# EAGLE design working (EAGLE 9.3.2)
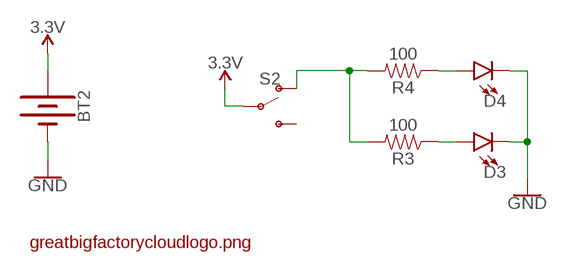
[diagram p0: schematic, sheet 1]

## Parts
BT2  BATTERY-20MM_PTH_KIT  [BATTCOM_20MM_PTH_KIT]
D3  LED5MM  [LED_5MM]
D4  LED5MM  [LED_5MM]
R3  100  100OHM-HORIZ_KIT-1/4W-1%  [AXIAL-0.3EZ]
R4  100  100OHM-HORIZ_KIT-1/4W-1%  [AXIAL-0.3EZ]
S2  SWITCH-SPDT-PTH-11.6X4.0MM-KIT  [SWITCH_SPDT_PTH_11.6X4.0MM_KIT]
U$1  GREATBIGFACTORYCLOUDLOGO#PNG  [GREATBIGFACTORYCLOUDLOGO#PNG]

## Nets
3.3V: BT2.1(+) S2.2(P)
GND: BT2.2(-) D3.K(C) D4.K(C)
N$1: R3.P$2 R4.P$2 S2.1(O)
N$5: D4.A R4.P$1
N$6: D3.A R3.P$1
Unconnected: S2.3(S)

## Library data of the parts
BT2 = SparkFun-Batteries:BATTERY: Battery - Single Cell A variety of battery chemistries, sizes, and footprints. Device List: 20MM_PTH - Coin Cell Battery Holder - 20mm (PTH) 20MM_PTH_KIT- Coin Cell battery Holder - 20 mm (PTH) kit version with special mask 6.8MM_PTH - Coin Cell Battery Holder - 6.8MM(SMD) 12MM_SMD - Coin Cell Battery Holder - 12mm (SMD) 12MM_PTH - Coin Cell Battery Holder - 12mm (PTH) 20MM_SMD - 20mm Coin Cell Battery Holder (SMD) (2 legs) Used on the Big Time Watch Kit 20MM_SMD_4LEGS - Coin Cell Battery Holder - 20mm (SMD) 20MM_SMD_4LEGS_OVERPASTE - Coin Cell Battery Holder - 20mm (SMD) (Over-paste on the legs) 24.5MM_PTH - Coin Cell Battery Holder - 24.5mm (PTH) 9V - 9V Battery Holder - PC Mount Used on the SparkFun SparkPunk Sound Kit and SparkFun SparkPunk Sequencer Kit 18650 - Battery Holder - 18650 (PTH) AA - Battery Holder - 1xAA (PTH) AAA - Battery Holder - 1xAAA (PTH) AA_KIT - Battery Holder - 1xAA (PTH) Special kit package - pads only have exposed copper on one side of the board. AAA_KIT - Battery Holder - 1xAAA (PTH) Special kit package - pads only have exposed copper on one side of the board.
D3 D4 = SparkFun-LED:LED: LED (Generic) Standard schematic elements and footprints for 5mm, 3mm, 1206, and 0603 sized LEDs. Generic LEDs with no color specified.
R3 R4 = SparkFun-Resistors:100OHM: 100Ω resistor A resistor is a passive two-terminal electrical component that implements electrical resistance as a circuit element. Resistors act to reduce current flow, and, at the same time, act to lower voltage levels within circuits. - Wikipedia; PROD_ID: RES-12181
S2 = SparkFun-Switches:SWITCH-SPDT: Single Pole, Double Throw (SPDT) Switch Single-pole, double-throw (SPDT) switch. Variant Overview SMD-AYZ0202 Surface Mount DPDT Switch (COM-00597) Used on e.g. LilyPad Arduino USB - ATmega32U4 Board PTH-11.6X4.0MM SPDT Mini Power Switch (COM-00102) Used on e.g. SparkFun Simon Says - Through-Hole Soldering Kit (KIT-10547) PTH-11.6X4.0MM-KIT KIT version of SPDT Mini Power Switch - Simplifies soldering by removing tStop of switch pins - only one side can be soldered. PTH-11.6X4.0MM-LOCK LOCK version of SPDT Mini Power Switch - Offset pins hold switch in place for easier soldering. SMD-RIGHT-ANGLE Surface Mount Right Angle Switch (COM-10860) Used on e.g. SparkFun ESP8266 Thing; PROD_ID: SWCH-08261; SF_SKU: COM-00102
U$1 = greatbigfactorycloudlogo#png:GREATBIGFACTORYCLOUDLOGO#PNG

## Board
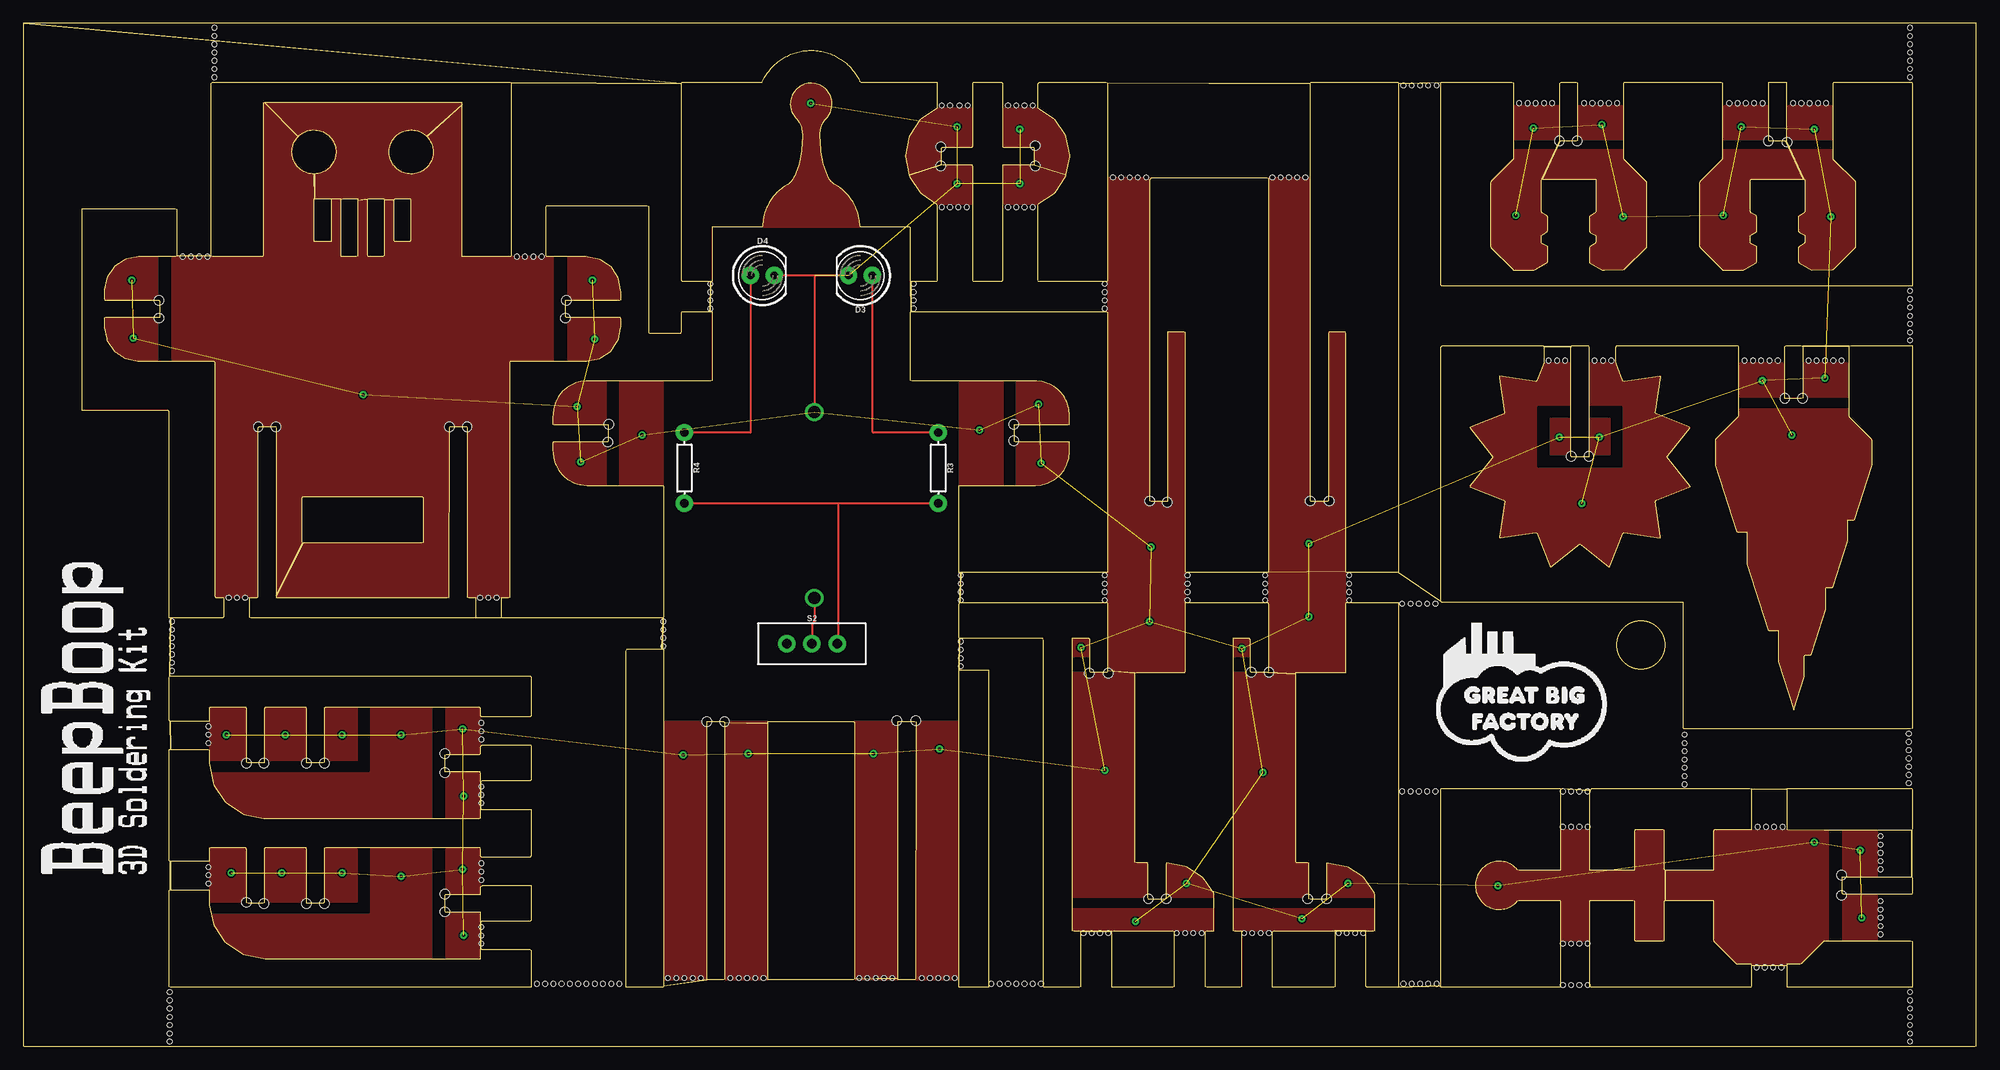
[diagram p1: board, top side]
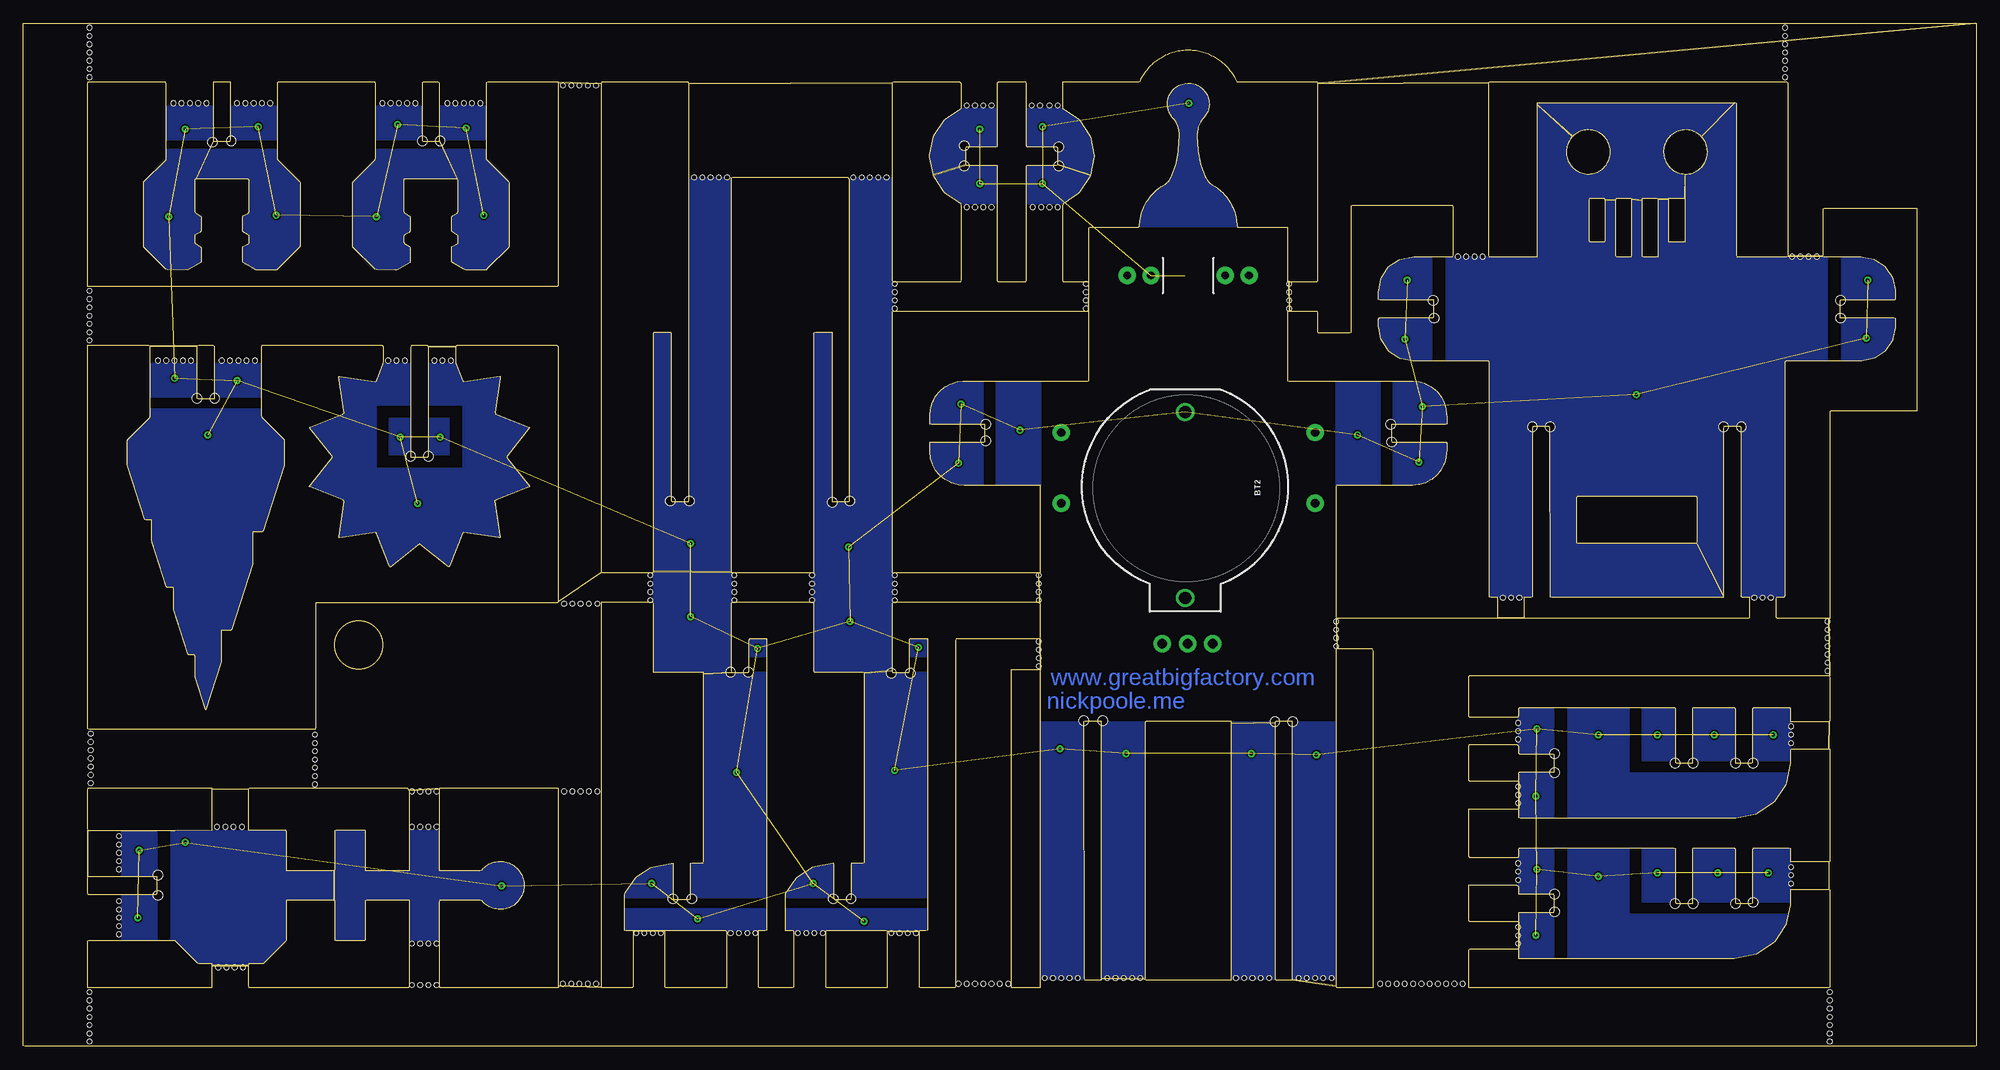
[diagram p2: board, bottom side, seen from below]

Size 210.07 x 110.08 mm. Coordinates in mm from the lower left corner, seen from the top.
Outline: 1497 segments
Outline: circle at 173.99,43.18 radius 2.59
Copper layers (1*16): Top 0.035mm / dielectric 1.5mm / Bottom 0.035mm
Design rules "default *": minimum track width 6mil, minimum drill 0.35mm, track to track 6mil, track to pad 6mil, pad to pad 6mil, via to via 6mil, smd to smd 6mil, copper to edge 0mil, drill to drill 6mil, minimum pad ring 10mil, minimum via ring 8mil, stop-mask expansion 4mil, vias tented up to drill 0mil, thermal gap 10mil
Holes 0.51 mm at 17.14,84.96 18.03,84.96 18.92,84.96 19.81,84.96 53.09,84.96 53.98,84.96 54.86,84.96 55.75,84.96 22.1,48.26 22.99,48.26 23.88,48.26 49.15,48.26 50.04,48.26 50.93,48.26 19.94,34.42 19.94,33.53 19.94,32.64 19.94,19.3 19.94,18.41 19.94,17.53 49.28,34.8 49.28,33.91 49.28,33.02 49.28,27.94 49.28,27.05 49.28,26.16 49.28,19.68 49.28,18.8 49.28,17.91 49.28,12.83 49.28,11.94 49.28,11.05 73.91,82.04 73.91,81.15 73.91,80.26 73.91,79.38 68.83,45.72 68.83,44.83 68.83,43.94 68.83,43.05 69.34,7.37 70.23,7.37 71.12,7.37 72.01,7.37 72.9,7.37 76.07,7.37 76.96,7.37 77.85,7.37 78.74,7.37 79.63,7.37 89.92,7.37 90.81,7.37 91.69,7.37 92.58,7.37 93.47,7.37 96.65,7.37 97.54,7.37 98.42,7.37 99.31,7.37 100.2,7.37 100.84,50.67 100.84,49.78 100.84,48.9 100.84,48.01 95.76,82.04 95.76,81.15 95.76,80.26 95.76,79.38 100.84,43.56 100.84,42.67 100.84,41.78 100.84,40.89 98.81,101.22 99.69,101.22 100.71,101.22 101.6,101.22 105.92,101.22 106.81,101.22 107.7,101.22 108.58,101.22 98.81,90.3 99.69,90.3 100.58,90.3 101.47,90.3 105.92,90.3 106.81,90.3 107.7,90.3 108.58,90.3 116.33,82.04 116.33,81.15 116.33,80.26 116.33,79.38 16,45.72 16,44.83 16,43.94 16,43.05 16,42.16 16,41.27 16,40.39 55.24,6.73 56.13,6.73 57.02,6.73 57.91,6.73 58.8,6.73 59.69,6.73 60.58,6.73 61.47,6.73 62.36,6.73 63.25,6.73 64.14,6.73 105.03,6.73 105.92,6.73 106.81,6.73 107.7,6.73 108.58,6.73 109.47,6.73 104.14,6.73 114.05,12.19 114.94,12.19 115.82,12.19 116.71,12.19 124.08,12.19 124.97,12.19 125.86,12.19 126.75,12.19 131.32,12.19 132.21,12.19 133.1,12.19 133.99,12.19 141.48,12.19 142.37,12.19 143.26,12.19 144.15,12.19 116.33,50.67 116.33,49.78 116.33,48.9 116.33,48.01 125.22,50.67 125.22,49.78 125.22,48.9 125.22,48.01 133.6,50.67 133.6,49.78 133.6,48.9 133.6,48.01 142.62,50.67 142.62,49.78 142.62,48.9 142.62,48.01 117.22,93.47 118.11,93.47 119,93.47 119.89,93.47 120.78,93.47 134.37,93.47 135.25,93.47 136.14,93.47 137.03,93.47 137.92,93.47 148.46,6.73 149.35,6.73 150.24,6.73 151.13,6.73 152.02,6.73 148.46,103.38 149.35,103.38 150.24,103.38 151.13,103.38 152.02,103.38 15.75,2.29 15.75,3.17 15.75,4.06 15.75,4.95 15.75,5.84 15.75,1.4 15.75,0.51 20.57,104.27 20.57,105.16 20.57,106.05 20.57,106.93 20.57,107.82 20.57,108.71 20.57,109.6 202.95,104.27 202.95,105.16 202.95,106.05 202.95,106.93 202.95,107.82 202.95,108.71 202.95,109.6 202.95,2.29 202.95,3.17 202.95,4.06 202.95,4.95 202.95,5.84 202.95,1.4 202.95,0.51 202.82,30.1 202.82,30.99 202.82,31.88 202.82,32.77 202.82,33.66 202.82,29.21 202.82,28.32 202.95,77.72 202.95,78.61 202.95,79.5 202.95,80.39 202.95,81.28 202.95,76.83 202.95,75.95 199.77,12.95 199.77,13.84 199.77,14.73 199.77,15.62 199.77,12.06 199.77,19.94 199.77,20.83 199.77,21.72 199.77,22.61 199.77,19.05 165.61,6.6 166.5,6.6 167.39,6.6 168.28,6.6 165.61,11.05 166.5,11.05 167.39,11.05 168.28,11.05 165.61,23.62 166.5,23.62 167.39,23.62 168.28,23.62 165.61,27.43 166.5,27.43 167.39,27.43 168.28,27.43 186.44,8.51 187.32,8.51 188.21,8.51 189.1,8.51 186.56,23.62 187.45,23.62 188.34,23.62 189.23,23.62 160.91,101.47 161.8,101.47 162.69,101.47 163.58,101.47 164.47,101.47 167.89,101.47 168.78,101.47 169.67,101.47 170.56,101.47 171.45,101.47 183.51,101.47 184.4,101.47 185.29,101.47 186.18,101.47 187.07,101.47 190.37,101.47 191.26,101.47 192.15,101.47 193.04,101.47 193.93,101.47 192.02,73.79 192.91,73.79 193.8,73.79 194.69,73.79 195.58,73.79 185.17,73.79 186.06,73.79 186.94,73.79 187.83,73.79 188.72,73.79 164.08,73.79 164.97,73.79 165.86,73.79 169.04,73.79 169.93,73.79 170.81,73.79 151.89,27.43 151,27.43 150.11,27.43 149.22,27.43 148.34,27.43 178.69,33.53 178.69,32.64 178.69,31.75 178.69,30.86 178.69,29.97 178.69,29.08 178.69,28.19 148.34,47.62 149.22,47.62 150.11,47.62 151,47.62 151.89,47.62
Holes 1.02 mm at 14.61,80.26 14.61,78.36 58.42,80.26 58.29,78.36 47.75,66.67 45.85,66.67 27.18,66.67 25.27,66.67 24,30.48 25.91,30.48 30.48,30.48 32.38,30.48 45.34,31.5 45.34,29.46 24,15.49 25.91,15.37 30.48,15.37 32.38,15.37 45.34,16.38 45.34,14.48 62.99,66.93 62.87,65.02 106.55,66.93 106.55,65.15 73.53,34.92 75.44,34.92 93.98,35.05 96.01,35.05 98.68,96.77 98.68,94.74 108.84,96.9 108.84,94.74 123.06,58.55 121.16,58.67 114.68,40.13 116.71,40.13 121.03,15.88 122.94,15.88 138.18,15.88 140.21,15.88 132.08,40.26 133.99,40.26 138.43,58.67 140.46,58.67 195.58,18.41 195.58,16.26 191.39,69.72 189.48,69.72 168.4,63.5 166.5,63.5 189.74,97.28 187.71,97.41 167.13,97.41 165.23,97.41

### Footprints (pad centres in the part's own frame; a part is rotated, then mirrored left to right if it is on the bottom)
BATTCOM_20MM_PTH_KIT = drill 1.3: 1 11.85,0; 2 -8.15,0
LED_5MM = drill 0.813 pad 1.88: A -1.27,0; K 1.27,0
AXIAL-0.3EZ = drill 0.9 pad 1.88: P$1 -3.81,0; P$2 3.81,0
SWITCH_SPDT_PTH_11.6X4.0MM_KIT = drill 1.016 pad 1.88: 1 0,2.718; 2 0,0; 3 0,-2.718

### Placement (x,y rotation side)
BT2  85.09,60.11 270 bottom
D3  90.04,82.93 180 top
D4  79.5,82.93 0 top
R3  98.42,62.23 270 top
R4  71.12,62.23 270 top
S2  84.84,43.31 270 top
U$1  161.29,38.1 0 top
U$2  [RECT1468#PNG]  7.62,35.56 90 top

### Tracks (layer width: path | path; a pad name or v marks a point on that pad's centre or on a via)
3.3V
  Top 0.203: BT2.1 85.09,45.72 84.84,45.47 S2.2
GND  (via drill 0.35)  (63 unrouted)
  Top 0.203: D3.K D4.K | 85.09,82.93 BT2.2
  other vias: 11.68,82.42 11.81,76.2 61.47,76.07 61.21,82.42 36.58,70.1 21.84,33.53 28.19,33.53 34.29,33.53 40.64,33.53 47.24,34.16 47.37,26.92 47.24,19.05 47.37,11.94 40.64,18.29 34.29,18.67 27.81,18.67 22.35,18.67 84.71,101.47 59.56,68.83 59.94,62.87 66.55,65.79 102.87,66.29 109.22,69.09 109.47,62.74 70.99,31.37 77.98,31.5 91.44,31.5 98.55,32 100.46,98.93 100.46,92.84 107.19,92.84 107.19,98.68 121.28,53.72 138.3,54.1 121.16,45.72 138.3,46.23 116.33,29.72 133.35,29.46 113.79,42.93 131.06,42.8 125.09,17.53 142.49,17.53 119.63,13.46 137.54,13.72 162.43,98.81 169.8,99.19 184.78,98.93 192.66,98.68 194.44,89.28 182.88,89.41 172.09,89.28 160.53,89.41 165.23,65.53 169.54,65.53 167.64,58.42 187.07,71.63 193.8,71.88 190.25,65.79 158.62,17.27 192.66,21.97 197.61,21.08 197.74,13.84
  cutout Top: 15.88,85.09 15.88,73.66 14.61,73.66 14.61,85.09
  cutout Top: 58.42,85.09 58.42,73.66 57.15,73.66 57.15,85.09
  cutout Bottom: 14.61,85.09 15.88,85.09 15.88,73.66 14.61,73.66
  cutout Bottom: 57.15,85.09 58.42,85.09 58.42,73.66 57.15,73.66
  cutout Bottom: 106.68,71.63 106.68,60.33 105.54,60.33 105.54,71.63
  cutout Bottom: 62.87,71.63 62.87,60.33 64.01,60.33 64.01,71.63
  cutout Top: 62.87,71.63 64.01,71.63 64.01,60.33 62.87,60.33
  cutout Top: 105.54,71.63 106.68,71.63 106.68,60.33 105.54,60.33
  cutout Top: 19.94,30.61 36.07,30.61 36.07,36.45 37.21,36.45 37.21,29.59 19.94,29.59
  cutout Top: 19.94,15.37 36.07,15.37 36.07,21.46 37.21,21.46 37.21,14.35 19.94,14.35
  cutout Bottom: 36.07,36.45 37.21,36.45 37.21,29.59 19.94,29.59 19.94,30.61 36.07,30.61
  cutout Bottom: 37.21,21.46 37.21,14.35 19.94,14.35 19.94,15.37 36.07,15.37 36.07,21.46
  cutout Bottom: 45.34,36.45 45.34,24.51 44.07,24.51 44.07,36.45 45.21,36.45
  cutout Bottom: 45.34,21.34 45.34,9.4 44.32,9.4 44.07,9.4 44.07,21.34
  cutout Top: 44.07,21.34 45.34,21.34 45.34,9.4 44.07,9.4
  cutout Top: 44.07,36.45 44.07,24.51 45.34,24.51 45.34,36.45
  cutout Top: 114.81,40.39 112.78,40.39 112.78,41.78 114.81,41.78
  cutout Bottom: 112.78,41.78 114.81,41.78 114.81,40.39 112.78,40.39
  cutout Bottom: 132.08,41.78 130.05,41.78 130.05,40.39 132.08,40.39
  cutout Top: 130.05,41.78 130.05,40.39 132.08,40.39 132.08,41.78
  cutout Top: 160.15,97.41 172.21,97.41 172.21,96.65 160.15,96.65
  cutout Bottom: 160.15,97.41 172.21,97.41 172.21,96.65 160.15,96.65
  cutout Bottom: 182.75,97.41 194.69,97.41 194.69,96.65 182.75,96.65
  cutout Top: 182.75,97.41 182.75,96.65 194.69,96.65 194.69,97.41
  cutout Top: 184.4,69.72 196.47,69.72 196.47,68.71 184.4,68.71
  cutout Bottom: 184.4,69.72 196.47,69.72 196.47,68.71 184.4,68.71
  cutout Bottom: 195.58,23.24 195.58,11.3 194.31,11.3 194.31,23.24
  cutout Top: 194.31,23.24 195.58,23.24 195.58,11.3 194.31,11.3
  cutout Top: 164.08,63.5 170.81,63.5 170.81,67.69 168.4,67.69 168.4,68.83 171.96,68.83 171.96,62.36 162.94,62.36 162.94,68.83 166.5,68.83 166.5,67.69 164.08,67.69
  cutout Bottom: 168.4,68.83 171.96,68.83 171.96,62.36 162.94,62.36 162.94,68.83 166.5,68.83 166.5,67.69 164.08,67.69 164.08,63.5 170.81,63.5 170.81,67.69 168.4,67.69
  cutout Bottom: 112.78,15.88 145.54,15.88 145.54,14.99 112.78,14.99
  cutout Top: 112.78,15.88 145.54,15.88 145.54,14.99 112.78,14.99
N$1
  Top 0.203: R3.P$2 87.63,58.42 | 87.63,58.42 R4.P$2 | S2.1 87.63,43.39 87.63,58.42
N$5
  Top 0.203: D4.A 78.23,66.04 R4.P$1
N$6
  Top 0.203: D3.A 91.31,66.17 91.44,66.04 R3.P$1
S$1
  pour Top: 84.31,103.59 83.92,103.47 83.74,103.39 83.57,103.29 83.41,103.18 83.25,103.05 83.11,102.91 82.98,102.76 82.86,102.6 82.77,102.42 82.67,102.25 82.56,101.86 82.53,101.67 82.51,101.47 82.52,101.27 82.62,100.68 82.71,100.5 82.99,99.98 83.14,99.84 83.39,99.53 83.48,99.35 83.66,98.99 83.72,98.81 83.8,98.21 83.82,98.01 83.72,96.42 83.46,95.04 83.42,94.85 83.01,93.72 82.93,93.54 82.72,93.2 82.59,93.05 82.45,92.91 82.3,92.78 81.79,92.47 81.63,92.35 81.32,92.1 81.17,91.97 80.75,91.53 80.63,91.38 80.4,91.05 80.28,90.89 80,90.36 79.93,90.18 79.72,89.61 79.59,89.03 79.56,88.83 79.52,88.23 79.63,88.15 89.82,88.15 90.01,88.16 89.96,88.76 89.94,88.96 89.81,89.54 89.76,89.73 89.55,90.3 89.46,90.47 89.27,90.82 89.17,91 88.82,91.48 88.68,91.63 88.41,91.92 88.26,92.06 87.8,92.43 87.63,92.54 87.28,92.74 87.12,92.85 86.83,93.13 86.62,93.47 86.52,93.64 86.12,94.77 86.07,94.96 85.82,96.34 85.79,96.54 85.7,97.93 85.71,98.13 85.78,98.73 85.83,98.92 85.99,99.28 86.08,99.46 86.33,99.77 86.47,99.91 86.78,100.42 86.88,100.6 87.02,101.38 86.98,101.78 86.93,101.98 86.87,102.17 86.79,102.35 86.7,102.52 86.59,102.69 86.46,102.85 86.33,103 86.02,103.25 85.67,103.44 85.49,103.51 85.3,103.57 85.1,103.6 84.9,103.62 84.7,103.63
S$2
  pour Top: 68.88,71.58 60.68,71.58 60.48,71.57 60.08,71.53 59.88,71.5 59.31,71.32 59.13,71.25 58.6,70.96 58.44,70.84 58.13,70.58 57.99,70.44 57.61,69.98 57.51,69.81 57.32,69.46 57.23,69.27 57.06,68.7 57.02,68.5 56.96,67.91 56.96,67.11 56.98,66.92 62.78,66.92 62.92,66.86 62.92,65.06 62.77,65.02 56.96,65.02 56.96,64.22 56.97,64.02 57.03,63.42 57.06,63.23 57.24,62.65 57.33,62.47 57.52,62.12 57.62,61.95 58,61.49 58.15,61.35 58.46,61.1 58.61,60.97 59.14,60.69 59.33,60.61 59.9,60.44 60.5,60.38 60.7,60.36 68.7,60.36 68.88,60.38
S$3
  pour Top: 68.88,34.95 68.88,7.31 68.93,7.16 73.54,7.16 73.54,34.8 73.49,34.95
S$4
  pour Top: 75.44,34.95 75.44,7.31 75.49,7.16 80.1,7.16 80.1,34.8 80.05,34.95
S$5
  pour Top: 89.42,34.95 89.42,7.31 89.47,7.16 94.08,7.16 94.08,34.8 94.03,34.95
S$6
  pour Top: 96.03,34.95 95.98,7.33 96.02,7.16 100.62,7.16 100.64,7.34 100.64,34.76 100.63,34.95
S$7
  pour Top: 100.64,60.36 108.84,60.36 109.04,60.38 109.44,60.42 109.64,60.44 110.21,60.62 110.39,60.7 110.92,60.98 111.08,61.11 111.39,61.36 111.53,61.5 111.91,61.96 112.01,62.14 112.2,62.49 112.29,62.67 112.46,63.24 112.5,63.44 112.56,64.04 112.56,64.84 112.54,65.02 106.74,65.02 106.6,65.08 106.6,66.88 106.76,66.92 112.56,66.92 112.56,67.72 112.55,67.92 112.49,68.52 112.46,68.72 112.28,69.29 112.19,69.47 112,69.82 111.9,69.99 111.52,70.46 111.37,70.59 111.06,70.85 110.91,70.97 110.38,71.26 110.19,71.33 109.62,71.51 109.42,71.53 109.02,71.57 108.82,71.58 100.82,71.58 100.64,71.56
S$8
  pour Top: 202 corners
S$9
  pour Top: 122.91,15.84 121.11,15.84 121,15.93 121,19.54 120.99,19.73 119.59,19.73 119.59,19.92 119.59,40.13 119.67,40.24 124.87,40.24 124.99,40.33 124.99,76.74 124.92,76.87 123.12,76.87 123.08,76.71 123.08,58.71 122.99,58.6 121.19,58.6 121.17,58.79 121.17,93.4 121.02,93.44 116.82,93.44 116.62,93.44 116.62,40.43 116.61,40.24 114.8,40.24 114.72,40.36 114.72,43.76 114.62,43.86 112.82,43.86 112.81,43.68 112.81,12.47 112.99,12.45 128,12.45 128.08,12.57 128.08,16.37 127.98,16.55 126.97,18.04 126.85,18.2 125.17,19.27 124.99,19.34 123.02,19.71 122.91,19.64
S$10
  pour Top: 94.87,95.78 95.31,93.61 95.41,93.45 96.42,91.95 96.54,91.79 98.2,90.67 98.38,90.61 101.99,90.61 102.14,90.65 102.14,94.66 102.1,94.81 98.89,94.82 98.76,94.89 98.76,96.69 98.9,96.74 102.11,96.73 102.14,96.9 102.14,100.9 101.99,100.94 98.38,100.94 98.2,100.88 96.54,99.76 96.42,99.6 95.41,98.11 95.31,97.94 94.87,95.78
S$11
  pour Top: 20,36.44 20,30.65 20,30.45 20.44,28.29 20.51,28.11 21.74,26.28 21.9,26.17 23.56,25.05 23.74,24.98 25.89,24.54 26.09,24.53 49.08,24.53 49.21,24.6 49.21,29.4 49.15,29.53 45.55,29.53 45.37,29.55 45.37,31.35 45.49,31.44 49.08,31.44 49.21,31.51 49.21,36.31 49.15,36.44 32.55,36.44 32.38,36.41 32.38,30.62 32.31,30.49 30.51,30.49 30.48,30.65 30.48,36.25 30.47,36.44 26.07,36.44 25.92,36.39 25.92,30.6 25.83,30.49 24.04,30.49 24.02,30.67 24.02,36.27 24,36.44
S$12
  pour Top: 140.2,15.84 138.4,15.84 138.29,15.93 138.29,19.54 138.28,19.73 136.88,19.73 136.88,19.92 136.88,40.13 136.96,40.24 142.16,40.24 142.28,40.33 142.28,76.74 142.21,76.87 140.41,76.87 140.37,76.71 140.37,58.71 140.28,58.6 138.48,58.6 138.47,58.79 138.47,93.4 138.31,93.44 134.11,93.44 133.91,93.44 133.91,40.43 133.9,40.24 132.1,40.24 132.01,40.36 132.01,43.76 131.92,43.86 130.12,43.86 130.1,43.68 130.1,12.47 130.29,12.45 145.29,12.45 145.37,12.57 145.37,16.37 145.28,16.55 144.27,18.04 144.15,18.2 142.46,19.27 142.28,19.34 140.31,19.71 140.2,19.64
S$13
  pour Top: 174.64,92.99 172.24,95.4 172.17,95.57 172.17,101.17 172.03,101.23 167.23,101.23 167.17,101.09 167.17,97.49 167.07,97.39 165.27,97.39 165.26,97.58 165.26,101.18 165.11,101.23 160.31,101.23 160.26,101.08 160.26,95.48 160.13,95.33 157.87,93.07 157.79,92.9 157.79,86.1 157.87,85.93 160.14,83.68 160.28,83.54 162.48,83.53 162.67,83.59 163.88,84.29 164,84.42 164,85.82 163.98,86.02 163.29,86.42 163.28,86.61 163.28,87.21 163.43,87.33 163.95,87.63 164,87.8 164,89.2 163.92,89.35 163.4,89.65 163.28,89.79 163.28,93.19 163.36,93.31 168.96,93.31 169.15,93.29 169.15,89.89 169.13,89.71 168.61,89.41 168.44,89.31 168.44,87.71 168.57,87.58 169.09,87.28 169.15,87.12 169.15,86.52 169.06,86.37 168.54,86.07 168.44,85.93 168.44,84.53 168.46,84.34 169.85,83.55 170.04,83.54 172.04,83.55 172.23,83.59 174.63,86 174.64,86.19
S$14
  pour Top: 20,21.35 20,15.56 20.01,15.36 20.44,13.2 20.51,13.02 21.74,11.19 21.9,11.08 23.56,9.96 23.74,9.89 25.89,9.45 26.09,9.44 49.08,9.44 49.21,9.51 49.21,14.31 49.15,14.44 45.55,14.44 45.37,14.47 45.37,16.26 45.49,16.35 49.09,16.35 49.21,16.42 49.21,21.22 49.15,21.35 32.55,21.35 32.38,21.33 32.38,15.53 32.31,15.4 30.51,15.4 30.48,15.56 30.48,21.16 30.47,21.35 26.08,21.35 25.93,21.3 25.93,15.51 25.84,15.4 24.04,15.4 24.02,15.58 24.02,21.18 24,21.35
S$15
  pour Top: 112.59,95.78 112.16,97.94 112.05,98.11 111.05,99.6 110.93,99.76 109.26,100.88 109.08,100.94 105.48,100.94 105.32,100.9 105.32,96.9 105.35,96.73 108.56,96.74 108.71,96.69 108.71,94.89 108.57,94.82 105.37,94.81 105.32,94.66 105.32,90.65 105.48,90.61 109.08,90.61 109.26,90.67 110.93,91.79 111.05,91.95 112.05,93.45 112.16,93.61 112.59,95.78
S$16
  pour Top: 197.14,92.99 194.73,95.4 194.67,95.57 194.67,101.17 194.53,101.23 189.73,101.23 189.67,101.09 189.67,97.49 189.57,97.39 187.77,97.39 187.76,97.58 187.76,101.18 187.61,101.23 182.81,101.23 182.76,101.08 182.76,95.48 182.63,95.33 180.37,93.07 180.29,92.9 180.29,86.1 180.37,85.93 182.64,83.68 182.78,83.54 184.98,83.53 185.17,83.59 186.38,84.29 186.5,84.42 186.5,85.82 186.48,86.02 185.79,86.42 185.78,86.61 185.78,87.21 185.92,87.33 186.44,87.63 186.5,87.8 186.5,89.2 186.42,89.35 185.9,89.65 185.78,89.79 185.78,93.19 185.86,93.31 191.46,93.31 191.65,93.29 191.65,89.89 191.62,89.71 191.1,89.41 190.93,89.31 190.93,87.71 191.06,87.58 191.58,87.28 191.65,87.12 191.65,86.52 191.56,86.37 191.04,86.07 190.93,85.93 190.93,84.53 190.96,84.35 192.34,83.55 192.54,83.54 194.54,83.55 194.72,83.59 197.12,86 197.14,86.19
S$17
  pour Top: 198.87,65.27 196.46,67.68 196.4,67.85 196.4,73.45 196.26,73.51 191.46,73.51 191.4,73.38 191.4,69.78 191.3,69.67 189.5,69.67 189.49,69.86 189.49,73.46 189.34,73.51 184.54,73.51 184.49,73.37 184.49,67.77 184.36,67.62 182.1,65.36 182.02,65.19 182.02,62.59 182.06,62.4 184.31,55.35 184.5,55.33 185.3,55.33 185.4,55.23 185.41,52.03 185.44,51.83 187.69,44.78 187.87,44.75 188.67,44.75 188.78,44.67 188.77,41.47 188.82,41.28 190.4,36.32 190.46,36.25 191.56,39.68 191.59,39.88 191.59,42.08 191.78,42.09 192.18,42.1 192.35,42.14 193.87,46.91 193.91,47.1 193.91,49.3 194.05,49.36 194.65,49.36 194.72,49.55 196.24,54.31 196.24,54.51 196.24,56.51 196.32,56.64 196.92,56.64 197.02,56.76 198.85,62.48 198.87,62.67
S$18
  pour Top: 179.33,66.59 175.6,68.06 175.56,68.21 176.12,71.97 176.07,72.09 172.32,71.53 172.12,71.5 171.39,73.37 171.29,73.51 168.48,73.51 168.4,73.4 168.4,63.59 168.39,63.41 166.58,63.41 166.49,63.52 166.49,73.32 166.49,73.51 163.68,73.51 163.54,73.44 162.8,71.57 162.65,71.52 158.89,72.08 158.76,72.05 159.35,68.09 159.18,68.01 155.64,66.62 155.65,66.49 158.01,63.52 158.07,63.36 155.57,60.23 155.75,60.16 159.28,58.76 159.33,58.61 158.77,54.85 158.81,54.72 162.77,55.31 162.84,55.13 164.24,51.6 164.36,51.61 167.34,53.98 167.49,54.02 170.63,51.53 170.7,51.71 172.09,55.25 172.25,55.3 176.01,54.73 176.13,54.78 175.54,58.73 175.72,58.81 179.26,60.2 179.24,60.33 176.88,63.3 176.83,63.46
S$19
  pour Top: 181.81,23.28 181.81,19.08 181.75,18.93 176.55,18.93 176.52,19.1 176.52,23.11 176.49,23.28 173.49,23.28 173.3,23.27 173.3,19.07 173.23,18.93 168.63,18.93 168.54,19.04 168.54,23.24 168.37,23.28 165.37,23.28 165.32,23.13 165.32,19.13 165.31,18.93 160.91,18.93 160.73,18.98 159.95,19.61 159.77,19.68 158.79,19.91 158.59,19.88 157.81,19.72 157.64,19.62 156.97,19.18 156.85,19.02 156.41,18.35 156.35,18.17 156.19,17.38 156.21,17.18 156.37,16.4 156.45,16.22 156.9,15.56 157.05,15.43 157.71,14.98 157.89,14.92 158.68,14.76 158.87,14.76 159.85,14.99 160.01,15.09 160.64,15.59 160.8,15.72 165.2,15.72 165.32,15.64 165.32,11.43 165.44,11.35 168.44,11.35 168.54,11.45 168.54,15.66 168.68,15.72 173.28,15.72 173.3,15.54 173.3,11.54 173.32,11.35 176.52,11.35 176.52,15.55 176.56,15.72 181.76,15.72 181.8,15.56 181.8,11.56 181.81,11.36 184.21,8.95 184.38,8.89 191.18,8.89 191.34,8.98 193.61,11.24 193.76,11.35 199.36,11.35 199.49,11.42 199.49,16.22 199.42,16.36 195.82,16.36 195.65,16.38 195.65,18.19 195.77,18.26 199.37,18.26 199.49,18.35 199.49,23.15 199.41,23.27 193.61,23.27
S$20
  pour Bottom: 84.31,103.59 83.92,103.47 83.74,103.39 83.57,103.29 83.41,103.18 83.25,103.05 83.11,102.91 82.98,102.76 82.86,102.6 82.77,102.42 82.67,102.25 82.56,101.86 82.53,101.67 82.51,101.47 82.52,101.27 82.62,100.68 82.71,100.5 82.99,99.98 83.14,99.84 83.39,99.53 83.48,99.35 83.66,98.99 83.72,98.81 83.8,98.21 83.82,98.01 83.72,96.42 83.46,95.04 83.42,94.85 83.01,93.72 82.93,93.54 82.72,93.2 82.59,93.05 82.45,92.91 82.3,92.78 81.79,92.47 81.63,92.35 81.32,92.1 81.17,91.97 80.75,91.53 80.63,91.38 80.4,91.05 80.28,90.89 80,90.36 79.93,90.18 79.72,89.61 79.59,89.03 79.56,88.83 79.52,88.23 79.63,88.15 89.82,88.15 90.01,88.16 89.96,88.76 89.94,88.96 89.81,89.54 89.76,89.73 89.55,90.3 89.46,90.47 89.27,90.82 89.17,91 88.82,91.48 88.68,91.63 88.41,91.92 88.26,92.06 87.8,92.43 87.63,92.54 87.28,92.74 87.12,92.85 86.83,93.13 86.62,93.47 86.52,93.64 86.12,94.77 86.07,94.96 85.82,96.34 85.79,96.54 85.7,97.93 85.71,98.13 85.78,98.73 85.83,98.92 85.99,99.28 86.08,99.46 86.33,99.77 86.47,99.91 86.78,100.42 86.88,100.6 87.02,101.38 86.98,101.78 86.93,101.98 86.87,102.17 86.79,102.35 86.7,102.52 86.59,102.69 86.46,102.85 86.33,103 86.02,103.25 85.67,103.44 85.49,103.51 85.3,103.57 85.1,103.6 84.9,103.62 84.7,103.63
S$21
  pour Bottom: 68.88,71.58 60.68,71.58 60.48,71.57 60.08,71.53 59.88,71.5 59.31,71.32 59.13,71.25 58.6,70.96 58.44,70.84 58.13,70.58 57.99,70.44 57.61,69.98 57.51,69.81 57.32,69.46 57.23,69.27 57.06,68.7 57.02,68.5 56.96,67.91 56.96,67.11 56.98,66.92 62.78,66.92 62.92,66.86 62.92,65.06 62.77,65.02 56.96,65.02 56.96,64.22 56.97,64.02 57.03,63.42 57.06,63.23 57.24,62.65 57.33,62.47 57.52,62.12 57.62,61.95 58,61.49 58.15,61.35 58.46,61.1 58.61,60.97 59.14,60.69 59.33,60.61 59.9,60.44 60.5,60.38 60.7,60.36 68.7,60.36 68.88,60.38
S$22
  pour Bottom: 68.88,34.95 68.88,7.31 68.93,7.16 73.54,7.16 73.54,34.8 73.49,34.95
S$23
  pour Bottom: 75.44,34.95 75.44,7.31 75.49,7.16 80.1,7.16 80.1,34.8 80.05,34.95
S$24
  pour Bottom: 89.42,34.95 89.42,7.31 89.47,7.16 94.08,7.16 94.08,34.8 94.03,34.95
S$25
  pour Bottom: 96.03,34.95 95.98,7.33 96.02,7.16 100.62,7.16 100.64,7.34 100.64,34.76 100.63,34.95
S$26
  pour Bottom: 100.64,60.36 108.84,60.36 109.04,60.38 109.44,60.42 109.64,60.44 110.21,60.62 110.39,60.7 110.92,60.98 111.08,61.11 111.39,61.36 111.53,61.5 111.91,61.96 112.01,62.14 112.2,62.49 112.29,62.67 112.46,63.24 112.5,63.44 112.56,64.04 112.56,64.84 112.54,65.02 106.74,65.02 106.6,65.08 106.6,66.88 106.76,66.92 112.56,66.92 112.56,67.72 112.55,67.92 112.49,68.52 112.46,68.72 112.28,69.29 112.19,69.47 112,69.82 111.9,69.99 111.52,70.46 111.37,70.59 111.06,70.85 110.91,70.97 110.38,71.26 110.19,71.33 109.62,71.51 109.42,71.53 109.02,71.57 108.82,71.58 100.82,71.58 100.64,71.56
S$27
  pour Bottom: 201 corners
S$28
  pour Bottom: 122.91,15.84 121.11,15.84 121,15.93 121,19.54 120.99,19.73 119.59,19.73 119.59,19.92 119.59,40.13 119.67,40.24 124.87,40.24 124.99,40.33 124.99,76.74 124.92,76.87 123.12,76.87 123.08,76.71 123.08,58.71 122.99,58.6 121.19,58.6 121.17,58.79 121.17,93.4 121.02,93.44 116.82,93.44 116.62,93.44 116.62,40.43 116.61,40.24 114.8,40.24 114.72,40.36 114.72,43.76 114.62,43.86 112.82,43.86 112.81,43.68 112.81,12.47 112.99,12.45 128,12.45 128.08,12.57 128.08,16.37 127.98,16.55 126.97,18.04 126.85,18.2 125.17,19.27 124.99,19.34 123.02,19.71 122.91,19.64
S$29
  pour Bottom: 94.87,95.78 95.31,93.61 95.41,93.45 96.42,91.95 96.54,91.79 98.2,90.67 98.38,90.61 101.99,90.61 102.14,90.65 102.14,94.66 102.1,94.81 98.89,94.82 98.76,94.89 98.76,96.69 98.9,96.74 102.11,96.73 102.14,96.9 102.14,100.9 101.99,100.94 98.38,100.94 98.2,100.88 96.54,99.76 96.42,99.6 95.41,98.11 95.31,97.94 94.87,95.78
S$30
  pour Bottom: 20,36.44 20,30.65 20,30.45 20.44,28.29 20.51,28.11 21.74,26.28 21.9,26.17 23.56,25.05 23.74,24.98 25.89,24.54 26.09,24.53 49.08,24.53 49.21,24.6 49.21,29.4 49.15,29.53 45.55,29.53 45.37,29.55 45.37,31.35 45.49,31.44 49.08,31.44 49.21,31.51 49.21,36.31 49.15,36.44 32.55,36.44 32.38,36.41 32.38,30.62 32.31,30.49 30.51,30.49 30.48,30.65 30.48,36.25 30.47,36.44 26.07,36.44 25.92,36.39 25.92,30.6 25.83,30.49 24.04,30.49 24.02,30.67 24.02,36.27 24,36.44
S$31
  pour Bottom: 140.2,15.84 138.4,15.84 138.29,15.93 138.29,19.54 138.28,19.73 136.88,19.73 136.88,19.92 136.88,40.13 136.96,40.24 142.16,40.24 142.28,40.33 142.28,76.74 142.21,76.87 140.41,76.87 140.37,76.71 140.37,58.71 140.28,58.6 138.48,58.6 138.47,58.79 138.47,93.4 138.31,93.44 134.11,93.44 133.91,93.44 133.91,40.43 133.9,40.24 132.1,40.24 132.01,40.36 132.01,43.76 131.92,43.86 130.12,43.86 130.1,43.68 130.1,12.47 130.29,12.45 145.29,12.45 145.37,12.57 145.37,16.37 145.28,16.55 144.27,18.04 144.15,18.2 142.46,19.27 142.28,19.34 140.31,19.71 140.2,19.64
S$32
  pour Bottom: 174.64,92.99 172.24,95.4 172.17,95.57 172.17,101.17 172.03,101.23 167.23,101.23 167.17,101.09 167.17,97.49 167.07,97.39 165.27,97.39 165.26,97.58 165.26,101.18 165.11,101.23 160.31,101.23 160.26,101.08 160.26,95.48 160.13,95.33 157.87,93.07 157.79,92.9 157.79,86.1 157.87,85.93 160.14,83.68 160.28,83.54 162.48,83.53 162.67,83.59 163.88,84.29 164,84.42 164,85.82 163.98,86.02 163.29,86.42 163.28,86.61 163.28,87.21 163.43,87.33 163.95,87.63 164,87.8 164,89.2 163.92,89.35 163.4,89.65 163.28,89.79 163.28,93.19 163.36,93.31 168.96,93.31 169.15,93.29 169.15,89.89 169.13,89.71 168.61,89.41 168.44,89.31 168.44,87.71 168.57,87.58 169.09,87.28 169.15,87.12 169.15,86.52 169.06,86.37 168.54,86.07 168.44,85.93 168.44,84.53 168.46,84.34 169.85,83.55 170.04,83.54 172.04,83.55 172.23,83.59 174.63,86 174.64,86.19
S$33
  pour Bottom: 20,21.35 20,15.56 20.01,15.36 20.44,13.2 20.51,13.02 21.74,11.19 21.9,11.08 23.56,9.96 23.74,9.89 25.89,9.45 26.09,9.44 49.08,9.44 49.21,9.51 49.21,14.31 49.15,14.44 45.55,14.44 45.37,14.47 45.37,16.26 45.49,16.35 49.09,16.35 49.21,16.42 49.21,21.22 49.15,21.35 32.55,21.35 32.38,21.33 32.38,15.53 32.31,15.4 30.51,15.4 30.48,15.56 30.48,21.16 30.47,21.35 26.08,21.35 25.93,21.3 25.93,15.51 25.84,15.4 24.04,15.4 24.02,15.58 24.02,21.18 24,21.35
S$34
  pour Bottom: 112.59,95.78 112.16,97.94 112.05,98.11 111.05,99.6 110.93,99.76 109.26,100.88 109.08,100.94 105.48,100.94 105.32,100.9 105.32,96.9 105.35,96.73 108.56,96.74 108.71,96.69 108.71,94.89 108.57,94.82 105.37,94.81 105.32,94.66 105.32,90.65 105.48,90.61 109.08,90.61 109.26,90.67 110.93,91.79 111.05,91.95 112.05,93.45 112.16,93.61 112.59,95.78
S$35
  pour Bottom: 197.14,92.99 194.73,95.4 194.67,95.57 194.67,101.17 194.53,101.23 189.73,101.23 189.67,101.09 189.67,97.49 189.57,97.39 187.77,97.39 187.76,97.58 187.76,101.18 187.61,101.23 182.81,101.23 182.76,101.08 182.76,95.48 182.63,95.33 180.37,93.07 180.29,92.9 180.29,86.1 180.37,85.93 182.64,83.68 182.78,83.54 184.98,83.53 185.17,83.59 186.38,84.29 186.5,84.42 186.5,85.82 186.48,86.02 185.79,86.42 185.78,86.61 185.78,87.21 185.92,87.33 186.44,87.63 186.5,87.8 186.5,89.2 186.42,89.35 185.9,89.65 185.78,89.79 185.78,93.19 185.86,93.31 191.46,93.31 191.65,93.29 191.65,89.89 191.62,89.71 191.1,89.41 190.93,89.31 190.93,87.71 191.06,87.58 191.58,87.28 191.65,87.12 191.65,86.52 191.56,86.37 191.04,86.07 190.93,85.93 190.93,84.53 190.96,84.35 192.34,83.55 192.54,83.54 194.54,83.55 194.72,83.59 197.12,86 197.14,86.19
S$36
  pour Bottom: 198.87,65.27 196.46,67.68 196.4,67.85 196.4,73.45 196.26,73.51 191.46,73.51 191.4,73.38 191.4,69.78 191.3,69.67 189.5,69.67 189.49,69.86 189.49,73.46 189.34,73.51 184.54,73.51 184.49,73.37 184.49,67.77 184.36,67.62 182.1,65.36 182.02,65.19 182.02,62.59 182.06,62.4 184.31,55.35 184.5,55.33 185.3,55.33 185.4,55.23 185.41,52.03 185.44,51.83 187.69,44.78 187.87,44.75 188.67,44.75 188.78,44.67 188.77,41.47 188.82,41.28 190.4,36.32 190.46,36.25 191.56,39.68 191.59,39.88 191.59,42.08 191.78,42.09 192.18,42.1 192.35,42.14 193.87,46.91 193.91,47.1 193.91,49.3 194.05,49.36 194.65,49.36 194.72,49.55 196.24,54.31 196.24,54.51 196.24,56.51 196.32,56.64 196.92,56.64 197.02,56.76 198.85,62.48 198.87,62.67
S$37
  pour Bottom: 179.33,66.59 175.6,68.06 175.56,68.21 176.12,71.97 176.07,72.09 172.32,71.53 172.12,71.5 171.39,73.37 171.29,73.51 168.48,73.51 168.4,73.4 168.4,63.59 168.39,63.41 166.58,63.41 166.49,63.52 166.49,73.32 166.49,73.51 163.68,73.51 163.54,73.44 162.8,71.57 162.65,71.52 158.89,72.08 158.76,72.05 159.35,68.09 159.18,68.01 155.64,66.62 155.65,66.49 158.01,63.52 158.07,63.36 155.57,60.23 155.75,60.16 159.28,58.76 159.33,58.61 158.77,54.85 158.81,54.72 162.77,55.31 162.84,55.13 164.24,51.6 164.36,51.61 167.34,53.98 167.49,54.02 170.63,51.53 170.7,51.71 172.09,55.25 172.25,55.3 176.01,54.73 176.13,54.78 175.54,58.73 175.72,58.81 179.26,60.2 179.24,60.33 176.88,63.3 176.83,63.46
S$38
  pour Bottom: 181.81,23.28 181.81,19.08 181.75,18.93 176.55,18.93 176.52,19.1 176.52,23.11 176.49,23.28 173.49,23.28 173.3,23.27 173.3,19.07 173.23,18.93 168.63,18.93 168.54,19.04 168.54,23.24 168.37,23.28 165.37,23.28 165.32,23.13 165.32,19.13 165.31,18.93 160.91,18.93 160.73,18.98 159.95,19.61 159.77,19.68 158.79,19.91 158.59,19.88 157.81,19.72 157.64,19.62 156.97,19.18 156.85,19.02 156.41,18.35 156.35,18.17 156.19,17.38 156.21,17.18 156.37,16.4 156.45,16.22 156.9,15.56 157.05,15.43 157.71,14.98 157.89,14.92 158.68,14.76 158.87,14.76 159.85,14.99 160.01,15.09 160.64,15.59 160.8,15.72 165.2,15.72 165.32,15.64 165.32,11.43 165.44,11.35 168.44,11.35 168.54,11.45 168.54,15.66 168.68,15.72 173.28,15.72 173.3,15.54 173.3,11.54 173.32,11.35 176.52,11.35 176.52,15.55 176.56,15.72 181.76,15.72 181.8,15.56 181.8,11.56 181.81,11.36 184.21,8.95 184.38,8.89 191.18,8.89 191.34,8.98 193.61,11.24 193.76,11.35 199.36,11.35 199.49,11.42 199.49,16.22 199.42,16.36 195.82,16.36 195.65,16.38 195.65,18.19 195.77,18.26 199.37,18.26 199.49,18.35 199.49,23.15 199.41,23.27 193.61,23.27

### Text on the board
Bottom: www.greatbigfactory.com | nickpoole.me